# EAGLE design PSoC_PyunPyun_Mini (EAGLE 7.2.0)
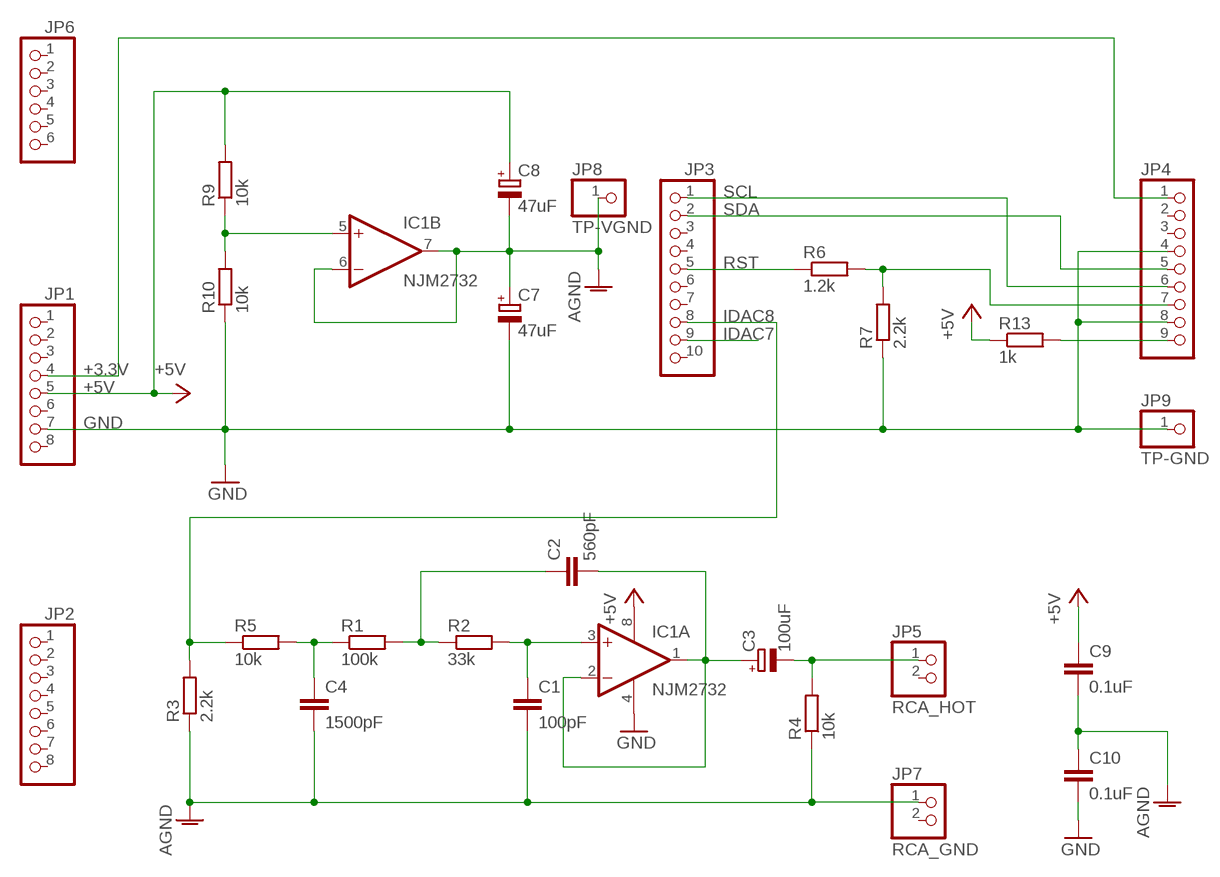
[diagram p0: schematic, sheet 1]

## Parts
C1  100pF  C-EU050-024X044  [C050-024X044]
C2  560pF  C-EU050-024X044  [C050-024X044]
C3  100uF  CPOL-EUE2.5-7  [E2,5-7]
C4  1500pF  C-EU050-024X044  [C050-024X044]
C7  47uF  CPOL-EUE2.5-5  [E2,5-5]
C8  47uF  CPOL-EUE2.5-5  [E2,5-5]
C9  0.1uF  C-EU050-024X044  [C050-024X044]
C10  0.1uF  C-EU050-024X044  [C050-024X044]
IC1  NJM2732  LM358N  [DIL08]
JP1  PINHD-1X8  [1X08]
JP2  PINHD-1X8  [1X08]
JP3  PINHD-1X10  [1X10]
JP4  PINHD-1X9  [1X09]
JP5  RCA_HOT  PINHD-1X2  [1X02]
JP6  PINHD-1X6  [1X06]
JP7  RCA_GND  PINHD-1X2  [1X02]
JP8  TP-VGND  PINHD-1X1  [1X01]
JP9  TP-GND  PINHD-1X1  [1X01]
R1  100k  R-EU_0207/7  [0207/7]
R2  33k  R-EU_0207/7  [0207/7]
R3  2.2k  R-EU_0207/7  [0207/7]
R4  10k  R-EU_0207/7  [0207/7]
R5  10k  R-EU_0207/7  [0207/7]
R6  1.2k  R-EU_0207/7  [0207/7]
R7  2.2k  R-EU_0207/7  [0207/7]
R9  10k  R-EU_0207/7  [0207/7]
R10  10k  R-EU_0207/7  [0207/7]
R13  1k  R-EU_0207/7  [0207/7]

## Nets
+3.3V: JP1.4 JP4.1
+5V: C8.+ C9.1 IC1.8(P:V+) JP1.5 R9.2 R13.1
AGND: C1.2 C4.2 C7.+ C8.- C9.2 C10.1 IC1.6(B:-IN) IC1.7(B:OUT) JP7.1 JP8.1 R3.1 R4.1
GND: C7.- C10.2 IC1.4(P:V-) JP1.7 JP4.4 JP4.8 JP9.1 R7.1 R10.1
IDAC7: JP3.9
IDAC8: JP3.8 R3.2 R5.1
N$1: C2.1 R1.2 R2.1
N$2: C4.1 R1.1 R5.2
N$3: C1.1 IC1.3(A:+IN) R2.2
N$4: C2.2 C3.+ IC1.1(A:OUT) IC1.2(A:-IN)
N$5: JP4.9 R13.2
N$6: JP3.5 R6.1
N$7: C3.- JP5.1 R4.2
N$8: IC1.5(B:+IN) R9.1 R10.2
RST: JP4.7 R6.2 R7.2
SCL: JP3.1 JP4.6
SDA: JP3.2 JP4.5
Unconnected: JP1.1 JP1.2 JP1.3 JP1.6 JP1.8 JP2.1 JP2.2 JP2.3 JP2.4 JP2.5 JP2.6 JP2.7 JP2.8 JP3.3 JP3.4 JP3.6 JP3.7 JP3.10 JP4.2 JP4.3 JP5.2 JP6.1 JP6.2 JP6.3 JP6.4 JP6.5 JP6.6 JP7.2

## Library data of the parts
C1 C2 C4 C9 C10 = rcl:C-EU: CAPACITOR, European symbol
C3 C7 C8 = rcl:CPOL-EU: POLARIZED CAPACITOR, European symbol
IC1 = linear:LM358: OP AMP also LM158; LM258; LM2904 Source: http://cache.national.com/ds/LM/LM158.pdf
JP1 JP2 = pinhead:PINHD-1X8: PIN HEADER
JP3 = pinhead:PINHD-1X10: PIN HEADER
JP4 = pinhead:PINHD-1X9: PIN HEADER
JP5 JP7 = pinhead:PINHD-1X2: PIN HEADER
JP6 = pinhead:PINHD-1X6: PIN HEADER
JP8 JP9 = pinhead:PINHD-1X1: PIN HEADER
R1-R7 R9 R10 R13 = rcl:R-EU_: RESISTOR, European symbol

## Board
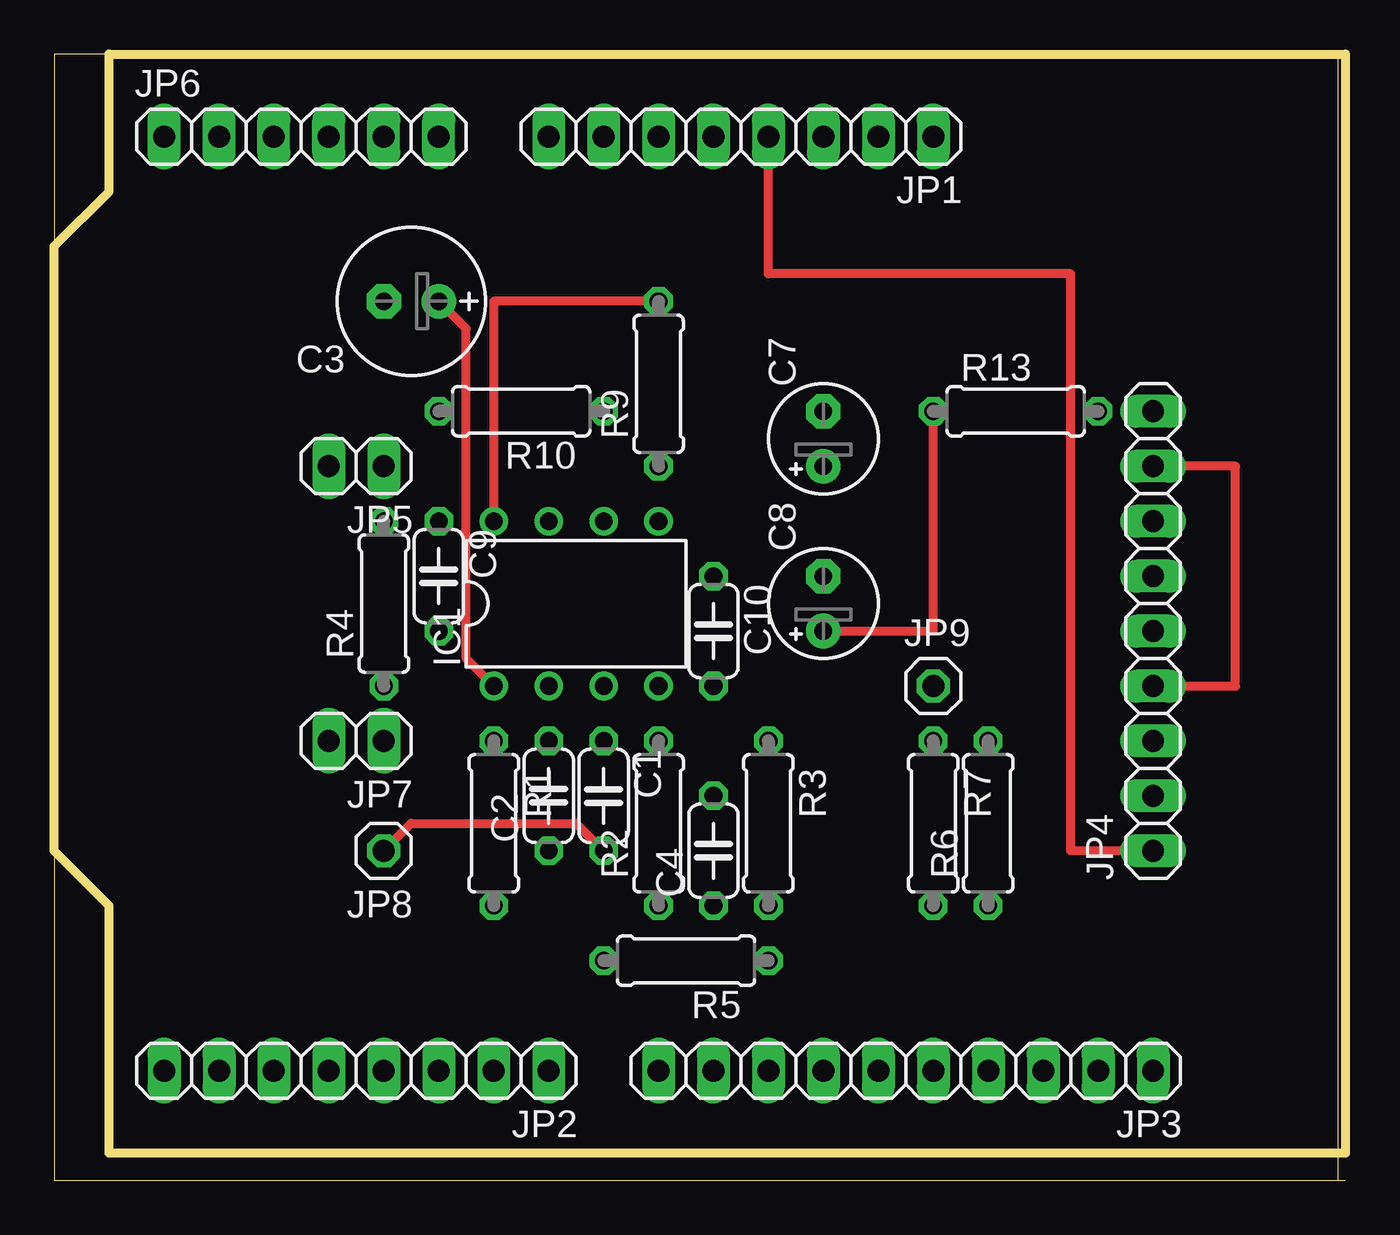
[diagram p1: board, top side]
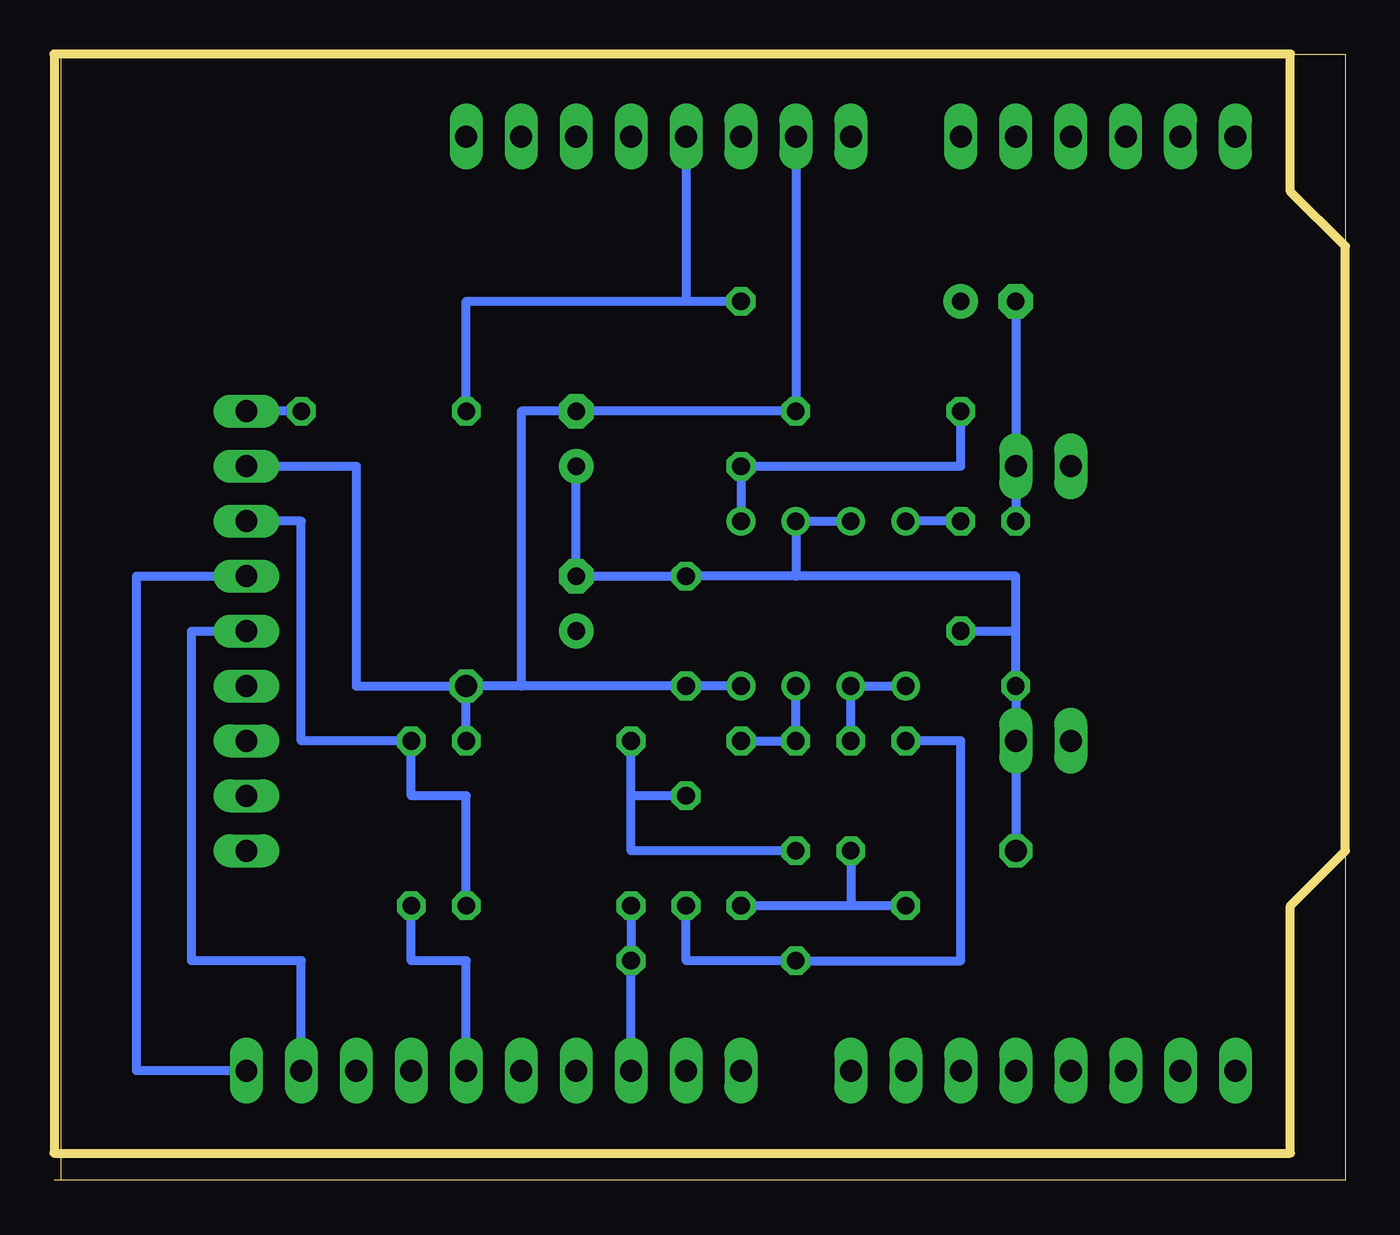
[diagram p2: board, bottom side, seen from below]

Size 59.69 x 52.07 mm. Coordinates in mm from the lower left corner, seen from the top.
Outline: 59.36,0 59.36,52.06 0,52.06 0,43.18
Outline: 0,15.24 0,0 59.36,0
Outline: 0,15.24 0,43.18
Outline: 0,43.18 2.54,45.72 2.54,52.07 59.69,52.07 59.69,1.27 2.54,1.27 2.54,12.7 0,15.24
Outline: 59.36,0 59.69,0
Copper layers (1*16): Top 0.035mm / dielectric 1.5mm / Bottom 0.035mm
Design rules "default": minimum track width 10mil, minimum drill 24mil, track to track 8mil, track to pad 8mil, pad to pad 8mil, via to via 8mil, smd to smd 8mil, copper to edge 40mil, drill to drill 8mil, minimum pad ring 10mil, minimum via ring 8mil, stop-mask expansion 4mil, vias tented up to drill 0mil, thermal gap 10mil
tKeepout: area 0,19.1 to 16.5,34.3; area 3.8,44.5 to 41.9,47; area 3.8,6.3 to 54.6,8.9; area 41.9,47 to 44.5,49.5

### Footprints (pad centres in the part's own frame; a part is rotated, then mirrored left to right if it is on the bottom)
C050-024X044 = drill 0.813 octagon: 1 -2.54,0; 2 2.54,0
E2,5-7 = drill 0.813 pad 1.6: + -1.27,0 | drill 0.813 pad 1.6 octagon: - 1.27,0
E2,5-5 = drill 0.813 pad 1.6: + -1.27,0 | drill 0.813 pad 1.6 octagon: - 1.27,0
DIL08 = drill 0.813 pad 1.27: 1 -3.81,-3.81; 2 -1.27,-3.81; 3 1.27,-3.81; 4 3.81,-3.81; 5 3.81,3.81; 6 1.27,3.81; 7 -1.27,3.81; 8 -3.81,3.81
1X08 = drill 1.016 long: 1 -8.89,0; 2 -6.35,0; 3 -3.81,0; 4 -1.27,0; 5 1.27,0; 6 3.81,0; 7 6.35,0; 8 8.89,0
1X10 = drill 1.016 long: 1 -11.43,0; 2 -8.89,0; 3 -6.35,0; 4 -3.81,0; 5 -1.27,0; 6 1.27,0; 7 3.81,0; 8 6.35,0; 9 8.89,0; 10 11.43,0
1X09 = drill 1.016 long: 1 -10.16,0; 2 -7.62,0; 3 -5.08,0; 4 -2.54,0; 5 0,0; 6 2.54,0; 7 5.08,0; 8 7.62,0; 9 10.16,0
1X02 = drill 1.016 long: 1 -1.27,0; 2 1.27,0
1X06 = drill 1.016 long: 1 -6.35,0; 2 -3.81,0; 3 -1.27,0; 4 1.27,0; 5 3.81,0; 6 6.35,0
1X01 = drill 1.016 octagon: 1 0,0
0207/7 = drill 0.813 octagon: 1 -3.81,0; 2 3.81,0

### Placement (x,y rotation side)
C1  25.4,17.78 270 top
C2  22.86,17.78 90 top
C3  16.51,40.64 180 top
C4  30.48,15.24 90 top
C7  35.56,34.29 90 top
C8  35.56,26.67 90 top
C9  17.78,27.94 270 top
C10  30.48,25.4 270 top
IC1  24.13,26.67 0 top
JP1  31.75,48.26 180 top
JP2  13.97,5.08 180 top
JP3  39.37,5.08 180 top
JP4  50.8,25.4 90 top
JP5  13.97,33.02 180 top
JP6  11.43,48.26 0 top
JP7  13.97,20.32 180 top
JP8  15.24,15.24 180 top
JP9  40.64,22.86 0 top
R1  20.32,16.51 270 top
R2  27.94,16.51 90 top
R3  33.02,16.51 270 top
R4  15.24,26.67 90 top
R5  29.21,10.16 180 top
R6  43.18,16.51 90 top
R7  40.64,16.51 270 top
R9  27.94,36.83 90 top
R10  21.59,35.56 180 top
R13  44.45,35.56 0 top

### Tracks (layer width: path | path; a pad name or v marks a point on that pad's centre or on a via)
+3.3V
  Top 0.406: JP4.1 46.99,15.24 46.99,41.91 33.02,41.91 JP1.4
+5V
  Top 0.406: R9.2 20.32,40.64 IC1.8 | C8.+ 40.64,25.4 R13.1
  Bottom 0.406: C9.1 IC1.8 | R13.1 40.64,40.64 30.48,40.64 | 30.48,40.64 R9.2 | JP1.5 30.48,40.64
AGND
  Top 0.406: JP8.1 16.51,16.51 24.13,16.51 C1.2
  Bottom 0.406: IC1.7 IC1.6 25.4,27.94 | JP8.1 JP7.1 R4.1 15.24,25.4 | 15.24,25.4 15.24,27.94 25.4,27.94 | 25.4,27.94 C10.1 C8.- C7.+ | C9.2 15.24,25.4 | C1.2 33.02,15.24 33.02,17.78 | 33.02,17.78 R3.1 | C4.2 33.02,17.78
GND
  Top 0.406: JP4.4 54.61,22.86 54.61,33.02 JP4.8
  Bottom 0.406: IC1.4 C10.2 38.1,22.86 | JP1.7 R10.1 C7.- 38.1,35.56 38.1,22.86 | JP4.8 45.72,33.02 45.72,22.86 JP9.1 | 38.1,22.86 JP9.1 | R7.1 JP9.1
IDAC8
  Bottom 0.406: R3.2 R5.1 JP3.8
N$1
  Bottom 0.406: C2.1 22.86,12.7 | 22.86,12.7 R2.1 | R1.2 22.86,12.7
N$2
  Bottom 0.406: R1.1 17.78,20.32 17.78,10.16 R5.2 30.48,10.16 C4.1
N$3
  Bottom 0.406: IC1.3 C1.1 R2.2
N$4
  Top 0.406: IC1.1 19.05,24.13 19.05,39.37 C3.+
  Bottom 0.406: C2.2 IC1.2 IC1.1
N$5
  Bottom 0.406: R13.2 JP4.9
N$6
  Bottom 0.406: JP3.5 40.64,10.16 43.18,10.16 R6.1
N$7
  Bottom 0.406: C3.- JP5.1 R4.2
N$8
  Bottom 0.406: IC1.5 R9.1 17.78,33.02 R10.2
RST
  Bottom 0.406: JP4.7 48.26,30.48 48.26,20.32 R6.2 43.18,17.78 40.64,17.78 R7.2
SCL
  Bottom 0.406: JP4.6 55.88,27.94 55.88,5.08 JP3.1
SDA
  Bottom 0.406: JP3.2 48.26,10.16 53.34,10.16 53.34,25.4 JP4.5